# Altium schematic sheet regulator.SchDoc: Linear Regulator
size A; Organization: Cal Poly Racing; engineer1: Graydon Wilson
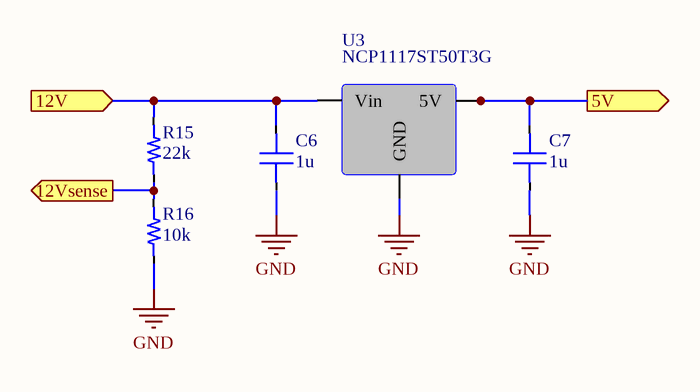
[diagram p0: regulator.SchDoc]

## Parts
C6  value 1u  [0603_CAP]  (hidden comment: Capacitor)
C7  value 1u  [0603_CAP]  (hidden comment: Capacitor)
R15  value 22k  [0603_RES]  (hidden comment: Resistor)
R16  value 10k  [0603_RES]  (hidden comment: Resistor)
U3  NCP1117ST50T3G  [SOT-223-4]

## Ports
5V (out), 12V (in), 12Vsense (out)

## Nets
GND: C6.1 C7.1 R16.1 U3.1(GND)
5V: C7.2 U3.2(5V) U3.4(Tab) ; port 5V
12V: C6.2 R15.2 U3.3(Vin) ; port 12V
12Vsense: R15.1 R16.2 ; port 12Vsense

## Notes on the sheet
- Date:
- Time:
- File:

## Library data of the parts
U3 = NCP1117ST50T3G: Vout: 5; Name: NCP1117ST50T3G; Type: Linear fixed; ComponentLink1Description: Digikey; ComponentLink1URL: https://www.digikey.com/product-detail/en/on-semiconductor/NCP1117ST50T3G/NCP1117ST50T3GOSCT-ND/1967217; ComponentLink2Description: Datasheet; ComponentLink2URL: https://www.onsemi.com/pub/Collateral/NCP1117-D.PDF
C6 C7 = Capacitor: Dielectric: *; Percent Tolerance: *; ESR: *
R15 R16 = Resistor: Tolerance: *